# Altium project T-Clock.PrjPcb
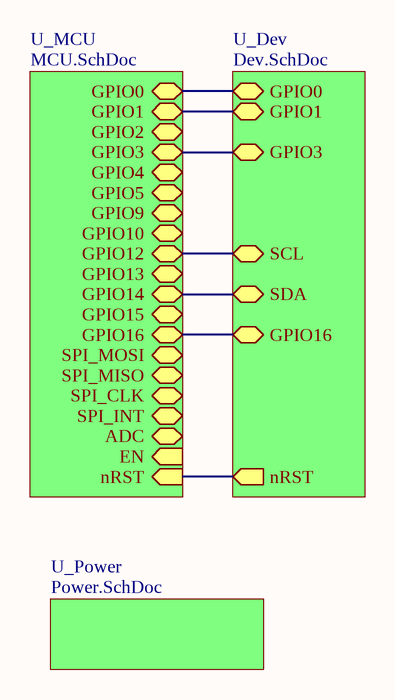
[diagram p0: T-Clock.SchDoc]
4 sheets, 30 parts. Net scope: hierarchical (ports join the sheet entries above them; power ports are global).
Board file: T-Clock.PcbDoc
Sheets:
  T-Clock.SchDoc
    U_Power = Power.SchDoc
    U_MCU = MCU.SchDoc
    U_Dev = Dev.SchDoc

## Sheet T-Clock.SchDoc
size 292 x 193 mm; Author: Power Lin; DocumentNumber: 1; Revision: 1B1; SheetNumber: 1; SheetTotal: 4; Website: wiki-power.com

### Sub-sheets
U_Dev = Dev.SchDoc: GPIO16 (bidir), nRST (out), GPIO0 (bidir), SCL (bidir), SDA (bidir), GPIO3 (bidir), GPIO1 (bidir)
U_MCU = MCU.SchDoc: nRST (in), ADC (bidir), EN (in), GPIO16 (bidir), GPIO14 (bidir), GPIO12 (bidir), SPI_MOSI (bidir), SPI_MISO (bidir), GPIO9 (bidir), GPIO1 (bidir), GPIO3 (bidir), GPIO5 (bidir), GPIO4 (bidir), SPI_CLK (bidir), SPI_INT (bidir), GPIO10 (bidir), GPIO13 (bidir), GPIO0 (bidir), GPIO2 (bidir), GPIO15 (bidir)
U_Power = Power.SchDoc: no entries

### Nets
NetC2_1: sheet U_MCU/nRST, sheet U_Dev/nRST
NetD1_K: sheet U_MCU/GPIO16, sheet U_Dev/GPIO16
NetP2_1: sheet U_MCU/GPIO14, sheet U_Dev/SDA
NetP2_2: sheet U_MCU/GPIO12, sheet U_Dev/SCL
NetQ2_3: sheet U_MCU/GPIO0, sheet U_Dev/GPIO0
NetR6_2: sheet U_MCU/GPIO3, sheet U_Dev/GPIO3
NetU1_22: sheet U_MCU/GPIO1, sheet U_Dev/GPIO1

### Notes on the sheet
- Author
- DocumentName
- ModifiedDate
- ProjectName
- SheetNumber
- SheetTotal
- Website
- Revision

## Sheet Power.SchDoc
size 292 x 193 mm; Author: Power Lin; DocumentNumber: 4; SheetNumber: 4; SheetTotal: 4; Website: wiki-power.com
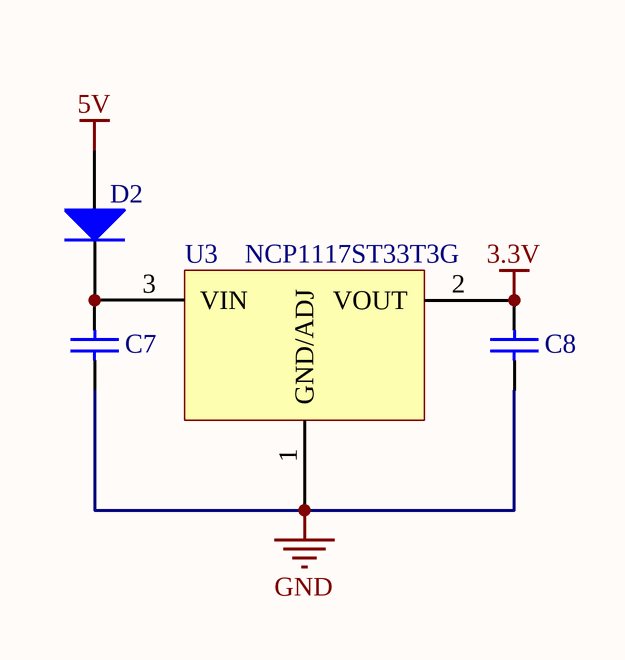
[diagram p1: Power.SchDoc]

### Parts
C7  10uF  [CAP-0603]  (value not drawn)
C8  10uF  [CAP-0603]  (value not drawn)
D2  SS14 6V  [SOD_123]  (value not drawn)
U3  NCP1117ST33T3G  [SOT-223]

### Nets
3.3V: C8.2 U3.2(VOUT)
5V: D2.1(A)
GND: C7.1 C8.1 U3.1(GND/ADJ)
NetC7_2: C7.2 D2.2(K) U3.3(VIN)

### Notes on the sheet
- Author
- DocumentName
- ModifiedDate
- ProjectName
- SheetNumber
- SheetTotal
- Website
- Revision

### Library data of the parts
C7 C8 = CAP: 贴片电容; ComponentLink1Description: 供应商链接; ComponentLink1URL: http://www.szlcsc.com/product/details_53938.html; Package: 0402; Supplier: LC; SuppliersPartNumber: C52923
D2 = DIODE: 二极管; ComponentLink1Description: 供应商链接; ComponentLink1URL: http://www.szlcsc.com/product/details_23178.html; Package: SMA(DO-214AC); Supplier: LC; SuppliersPartNumber: C22452
U3 = NCP1117: NCP1117, NCV1117. 1.0 A Low-Dropout Positive  Fixed and Adjustable  Voltage Regulators

## Sheet MCU.SchDoc
size 292 x 193 mm; Author: Power Lin; DocumentNumber: 2; SheetNumber: 2; SheetTotal: 4; Website: wiki-power.com
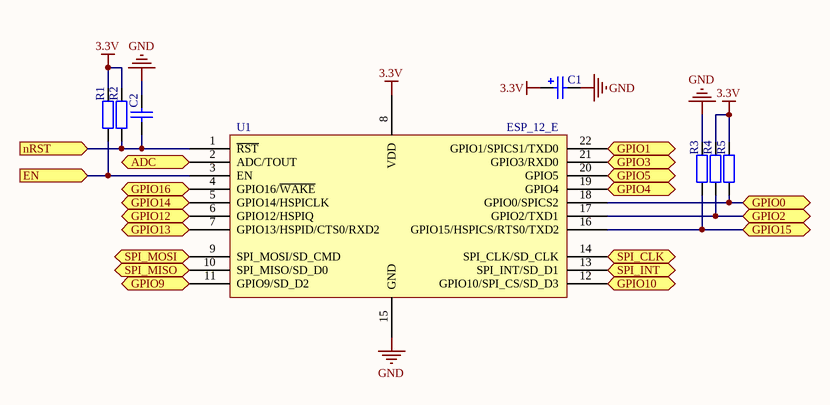
[diagram p2: MCU.SchDoc]

### Parts
C1  100uF  [CASE-B_3528]  (value not drawn)
C2  100nF  [CAP-0603]  (value not drawn)
R1  12K  [R-0603]  (value not drawn)
R2  12K  [R-0603]  (value not drawn)
R3  12K  [R-0603]  (value not drawn)
R4  12K  [R-0603]  (value not drawn)
R5  12K  [R-0603]  (value not drawn)
U1  ESP_12_E  [ESP_12_E_L]

### Ports
ADC (bidir), EN (in), GPIO0 (bidir), GPIO1 (bidir), GPIO2 (bidir), GPIO3 (bidir), GPIO4 (bidir), GPIO5 (bidir), GPIO9 (bidir), GPIO10 (bidir), GPIO12 (bidir), GPIO13 (bidir), GPIO14 (bidir), GPIO15 (bidir), GPIO16 (bidir), nRST (in), SPI_CLK (bidir), SPI_INT (bidir), SPI_MISO (bidir), SPI_MOSI (bidir)

### Nets
3.3V: C1.1 R1.2 R2.2 R4.2 R5.2 U1.8(VDD)
GND: C1.2 C2.2 R3.2 U1.15(GND)
NetC2_1: C2.1 R2.1 U1.1(~{RST}) ; port nRST
NetD1_K: U1.4(GPIO16/~{WAKE}) ; port GPIO16
NetP2_1: U1.5(GPIO14/HSPICLK) ; port GPIO14
NetP2_2: U1.6(GPIO12/HSPIQ) ; port GPIO12
NetQ2_3: R5.1 U1.18(GPIO0/SPICS2) ; port GPIO0
NetR1_1: R1.1 U1.3(EN) ; port EN
NetR3_1: R3.1 U1.16(GPIO15/HSPICS/RTS0/TXD2) ; port GPIO15
NetR4_1: R4.1 U1.17(GPIO2/TXD1) ; port GPIO2
NetR6_2: U1.21(GPIO3/RXD0) ; port GPIO3
NetU1_2: U1.2(ADC/TOUT) ; port ADC
NetU1_7: U1.7(GPIO13/HSPID/CTS0/RXD2) ; port GPIO13
NetU1_9: U1.9(SPI_MOSI/SD_CMD) ; port SPI_MOSI
NetU1_10: U1.10(SPI_MISO/SD_D0) ; port SPI_MISO
NetU1_11: U1.11(GPIO9/SD_D2) ; port GPIO9
NetU1_12: U1.12(GPIO10/SPI_CS/SD_D3) ; port GPIO10
NetU1_13: U1.13(SPI_INT/SD_D1) ; port SPI_INT
NetU1_14: U1.14(SPI_CLK/SD_CLK) ; port SPI_CLK
NetU1_19: U1.19(GPIO4) ; port GPIO4
NetU1_20: U1.20(GPIO5) ; port GPIO5
NetU1_22: U1.22(GPIO1/SPICS1/TXD0) ; port GPIO1

### Notes on the sheet
- Author
- DocumentName
- ModifiedDate
- ProjectName
- SheetNumber
- SheetTotal
- Website
- Revision

### Library data of the parts
C1 = CAP-POL: 贴片电容-有极性; ComponentLink1Description: 供应商链接; ComponentLink1URL: http://www.szlcsc.com/product/details_16815.html; Package: 3528; Supplier: LC; SuppliersPartNumber: C16133
C2 = CAP: 贴片电容; ComponentLink1Description: 供应商链接; ComponentLink1URL: http://www.szlcsc.com/product/details_53938.html; Package: 0402; Supplier: LC; SuppliersPartNumber: C52923
R1-R5 = RES: 贴片电阻; Package: 0805; Supplier: LC; SuppliersPartNumber: C17798
U1 = ESP_12_E: ESP-12 Wi-Fi Module by AI-Thinker; IC: ESP8266-EX; Vendor: Ai-thinker

## Sheet Dev.SchDoc
size 292 x 193 mm; Author: Power Lin; DocumentNumber: 3; SheetNumber: 3; SheetTotal: 4; Website: wiki-power.com
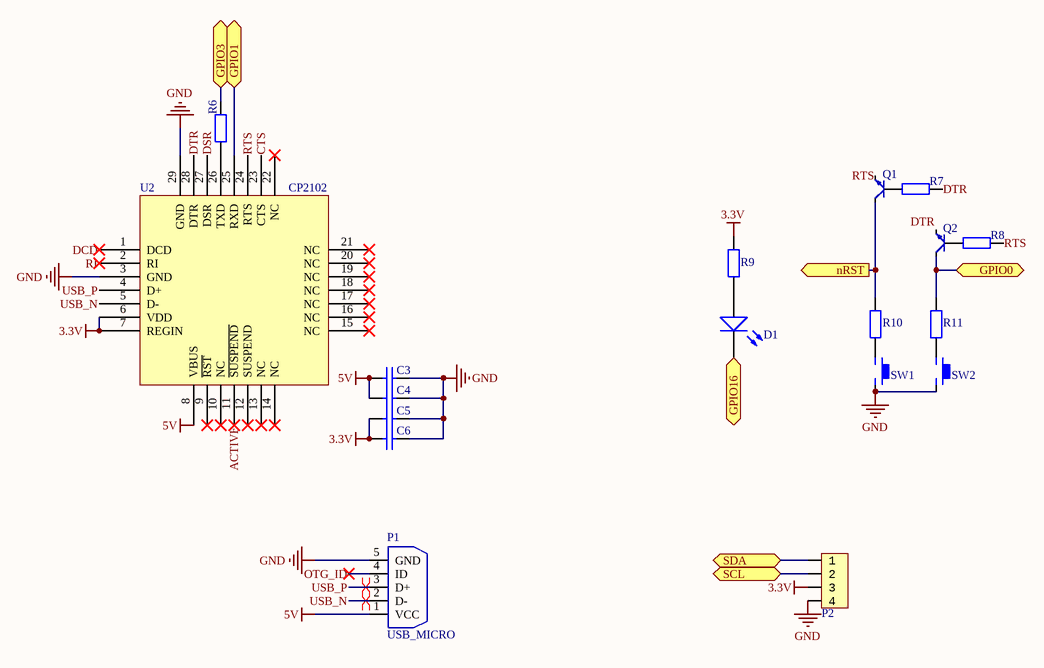
[diagram p3: Dev.SchDoc]

### Parts
C3  100nF  [CAP-0603]  (value not drawn)
C4  10uF  [CAP-0603]  (value not drawn)
C5  100nF  [CAP-0603]  (value not drawn)
C6  10uF  [CAP-0603]  (value not drawn)
D1  BLUE  [LED_0603]  (value not drawn)
P1  USB_MICRO  [MICROUSB-SOP]
P2  HDR1x4_2.54  [HDR1x4_2.54_180]  (value not drawn)
Q1  S8050  [SOT-23-3]  (value not drawn)
Q2  S8050  [SOT-23-3]  (value not drawn)
R6  470R  [R-0603]  (value not drawn)
R7  1R  [R-0603]  (value not drawn)
R8  1R  [R-0603]  (value not drawn)
R9  470R  [R-0603]  (value not drawn)
R10  470R  [R-0603]  (value not drawn)
R11  470R  [R-0603]  (value not drawn)
SW1  KEY  [KEY-4P-4.2*3.4*2.5]  (value not drawn)
SW2  KEY  [KEY-4P-4.2*3.4*2.5]  (value not drawn)
U2  CP2102  [QFN28]

### Ports
GPIO0 (bidir), GPIO1 (bidir), GPIO3 (bidir), GPIO16 (bidir), nRST (out), SCL (bidir), SDA (bidir)

### Nets
3.3V: C5.1 C6.1 P2.3 R9.2 U2.6(VDD) U2.7(REGIN)
5V: C3.1 C4.1 P1.1(VCC) U2.8(VBUS)
GND: C3.2 C4.2 C5.2 C6.2 P1.5(GND) P2.4 SW1.2 SW2.2 U2.3(GND) U2.29(GND)
ACTIVE: U2.11(~{SUSPEND})
CTS: U2.23(CTS)
DCD: U2.1(DCD)
DSR: U2.27(DSR)
DTR: Q2.2(E) R7.2 U2.28(DTR)
OTG_ID: P1.4(ID)
RI: U2.2(RI)
RTS: Q1.2(E) R8.2 U2.24(RTS)
USB_N: P1.2(D-) U2.5(D-)
USB_P: P1.3(D+) U2.4(D+)
NetC2_1: Q1.3(C) R10.2 ; port nRST
NetD1_A: D1.A R9.1
NetD1_K: D1.K ; port GPIO16
NetP2_1: P2.1 ; port SDA
NetP2_2: P2.2 ; port SCL
NetQ1_1: Q1.1(B) R7.1
NetQ2_1: Q2.1(B) R8.1
NetQ2_3: Q2.3(C) R11.2 ; port GPIO0
NetR6_1: R6.1 U2.26(TXD)
NetR6_2: R6.2 ; port GPIO3
NetR10_1: R10.1 SW1.1
NetR11_1: R11.1 SW2.1
NetU1_22: U2.25(RXD) ; port GPIO1

Not connected (* = marked no-connect by the designer): U2 9(~{RST})* 10(NC)* 12(SUSPEND)* 13(NC)* 14(NC)* 15(NC)* 16(NC)* 17(NC)* 18(NC)* 19(NC)* 20(NC)* 21(NC)* 22(NC)*

### Layout directives
differential pair: USB_N, USB_P

### Notes on the sheet
- Author
- DocumentName
- ModifiedDate
- ProjectName
- SheetNumber
- SheetTotal
- Website
- Revision

### Library data of the parts
C3-C6 = CAP: 贴片电容; ComponentLink1Description: 供应商链接; ComponentLink1URL: http://www.szlcsc.com/product/details_53938.html; Package: 0402; Supplier: LC; SuppliersPartNumber: C52923
D1 = LED: 发光二极管; ComponentLink1Description: 供应商链接; ComponentLink1URL: http://www.szlcsc.com/product/details_2663.html; Package: 0603; Supplier: LC; SuppliersPartNumber: C2290
P1 = USB_MICRO: USB 接口
P2 = HDR1x4_2.54: Header
Q1 Q2 = BJT_NPN: 晶体管
R6-R11 = RES: 贴片电阻; Package: 0805; Supplier: LC; SuppliersPartNumber: C17798
SW1 SW2 = KEY: 按键开关
U2 = CP2102: USB to UART

## Nets that join several sheets
3.3V: Power (C8.2 U3.2), MCU (6 pins), Dev (6 pins)
5V: Power (D2.1), Dev (C3.1 C4.1 P1.1 U2.8)
GND: Power (C7.1 C8.1 U3.1), MCU (C1.2 C2.2 R3.2 U1.15), Dev (10 pins)
NetC2_1: MCU (C2.1 R2.1 U1.1), Dev (Q1.3 R10.2)
NetD1_K: MCU (U1.4), Dev (D1.K)
NetP2_1: MCU (U1.5), Dev (P2.1)
NetP2_2: MCU (U1.6), Dev (P2.2)
NetQ2_3: MCU (R5.1 U1.18), Dev (Q2.3 R11.2)
NetR6_2: MCU (U1.21), Dev (R6.2)
NetU1_22: MCU (U1.22), Dev (U2.25)